# Altium schematic sheet Vemos Battry Shield.SchDoc
size A; SheetNumber: 2; SheetTotal: 6
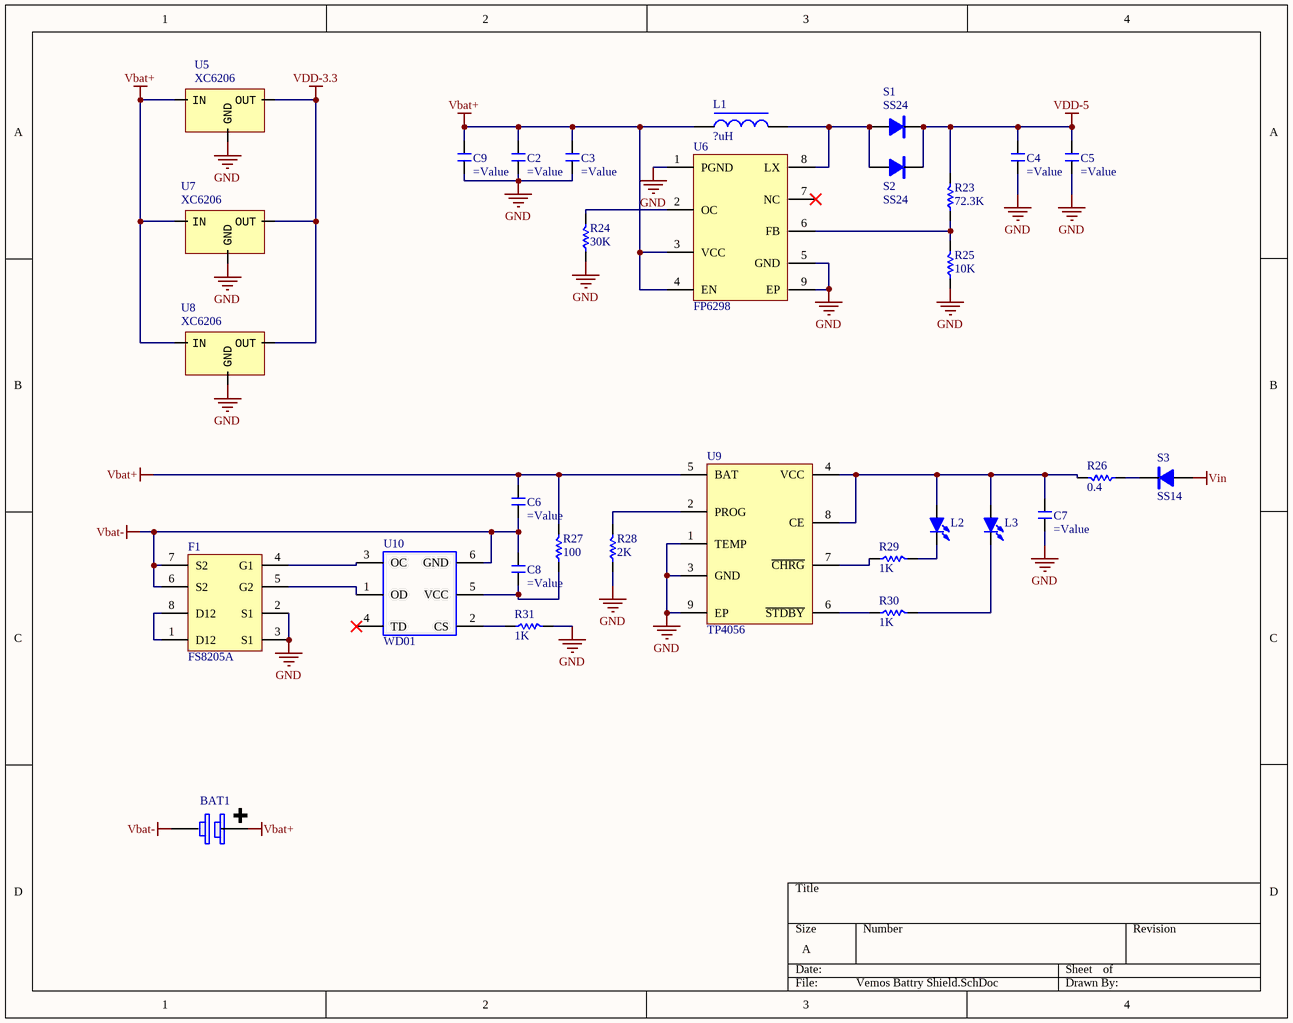
[diagram p0: Vemos Battry Shield.SchDoc]

## Parts
BAT1  Battery 1850  [18650 SINGLE 2]  (value not drawn)
C2  (no value)  [C 0603]
C3  (no value)  [C 0603]
C4  (no value)  [C 0603]
C5  (no value)  [C 0603]
C6  (no value)  [C 0603]
C7  (no value)  [C 0603]
C8  (no value)  [C 0603]
C9  (no value)  [C 0603]
F1  FS8205A  [SSOP8_L]
L1  ?uH  [WHC1040]
L2  LED-SMD  [LED 0805G]  (value not drawn)
L3  LED-SMD  [LED 0805R]  (value not drawn)
R23  72.3K  [R 0603]
R24  30K  [R 0603]
R25  10K  [R 0603]
R26  0.4  [R 0603]
R27  100  [R 0603]
R28  2K  [R 0603]
R29  1K  [R 0603]
R30  1K  [R 0603]
R31  1K  [R 0603]
S1  SS24  [SMA]
S2  SS24  [SMA]
S3  SS14  [SMA]
U5  XC6206  [SOT23-3N]
U6  FP6298  [SOP8_L-EP]
U7  XC6206  [SOT23-3N]
U8  XC6206  [SOT23-3N]
U9  TP4056  [SOP8_M-EP]
U10  WD01  [SOT23-6M]

## Nets
GND: C2.1 C3.1 C4.1 C5.1 C7.1 C9.1 F1.2(S1) F1.3(S1) R24.1 R25.1 R28.1 R31.2 U5.1(GND) U6.1(PGND) U6.5(GND) U6.9(EP) U7.1(GND) U8.1(GND) U9.1(TEMP) U9.3(GND) U9.9(EP)
Vbat+: BAT1.1(+) C2.2 C3.2 C6.2 C9.2 L1.1 R27.2 U5.3(IN) U6.3(VCC) U6.4(EN) U7.3(IN) U8.3(IN) U9.5(BAT)
Vbat-: BAT1.2(-) C6.1 C8.2 F1.6(S2) F1.7(S2) U10.6(GND)
VDD-3.3: U5.2(OUT) U7.2(OUT) U8.2(OUT)
VDD-5: C4.2 C5.2 R23.2 S1.2(K) S2.2(K)
Vin: S3.1(A)
NetC7_2: C7.2 L2.1(A) L3.1(A) R26.2 U9.4(VCC) U9.8(CE)
NetC8_1: C8.1 R27.1 U10.5(VCC)
NetF1_1: F1.1(D12) F1.8(D12)
NetF1_4: F1.4(G1) U10.3(OC)
NetF1_5: F1.5(G2) U10.1(OD)
NetL1_2: L1.2 S1.1(A) S2.1(A) U6.8(LX)
NetL2_2: L2.2(K) R29.2
NetL3_2: L3.2(K) R30.2
NetR23_1: R23.1 R25.2 U6.6(FB)
NetR24_2: R24.2 U6.2(OC)
NetR26_1: R26.1 S3.2(K)
NetR28_2: R28.2 U9.2(PROG)
NetR29_1: R29.1 U9.7(~{CHRG})
NetR30_1: R30.1 U9.6(~{STDBY})
NetR31_1: R31.1 U10.2(CS)

Not connected (* = marked no-connect by the designer): U6 7(NC)*; U10 4(TD)*

## Library data of the parts
C2-C9 = C: Non-polar patch capacitor; BOM名称: 无极性贴片电容; 版权归属: 源创客; 学习资源: www.ooocke.com
F1 = FS8205A: Dual N-Channel Enhancement Mode Power MOSFET
L1 = L-WHC: One-piece high current inductor
L2 L3 = LED-SMD: Patch LED; BOM名称: 贴片LED; 版权归属: 源创客; 学习资源: www.ooocke.com
R23-R31 = R: Chip resistor; 版权归属: 源创客; BOM名称: Chip resistor; 学习资源: www.ooocke.com
S1 S2 = SS24: Schottky diodes; BOM名称: 肖特基二极管; 版权归属: 源创客; 属性: 40V/2A; 学习资源: www.ooocke.com
S3 = SS14: Schottky diodes; BOM名称: 肖特基二极管; 版权归属: 源创客; 属性: 40V/1A; 学习资源: www.ooocke.com
U5 U7 U8 = XC6206: Power; Type: *; Value: *
U6 = FP6298: FP6298 Low-Noise 4.5A Step-Up Current Mode PWM
U9 = TP4056: Lithium battery charge management; BOM名称: 锂电池充电管理; 版权归属: 源创客; 学习资源: www.ooocke.com
U10 = WD01: Lithium battery overcurrent protection IC; BOM名称: 过流保护IC; 版权归属: 源创客; 学习资源: www.ooocke.com